# EAGLE schematic gbg_v01 (EAGLE 9.1.3)
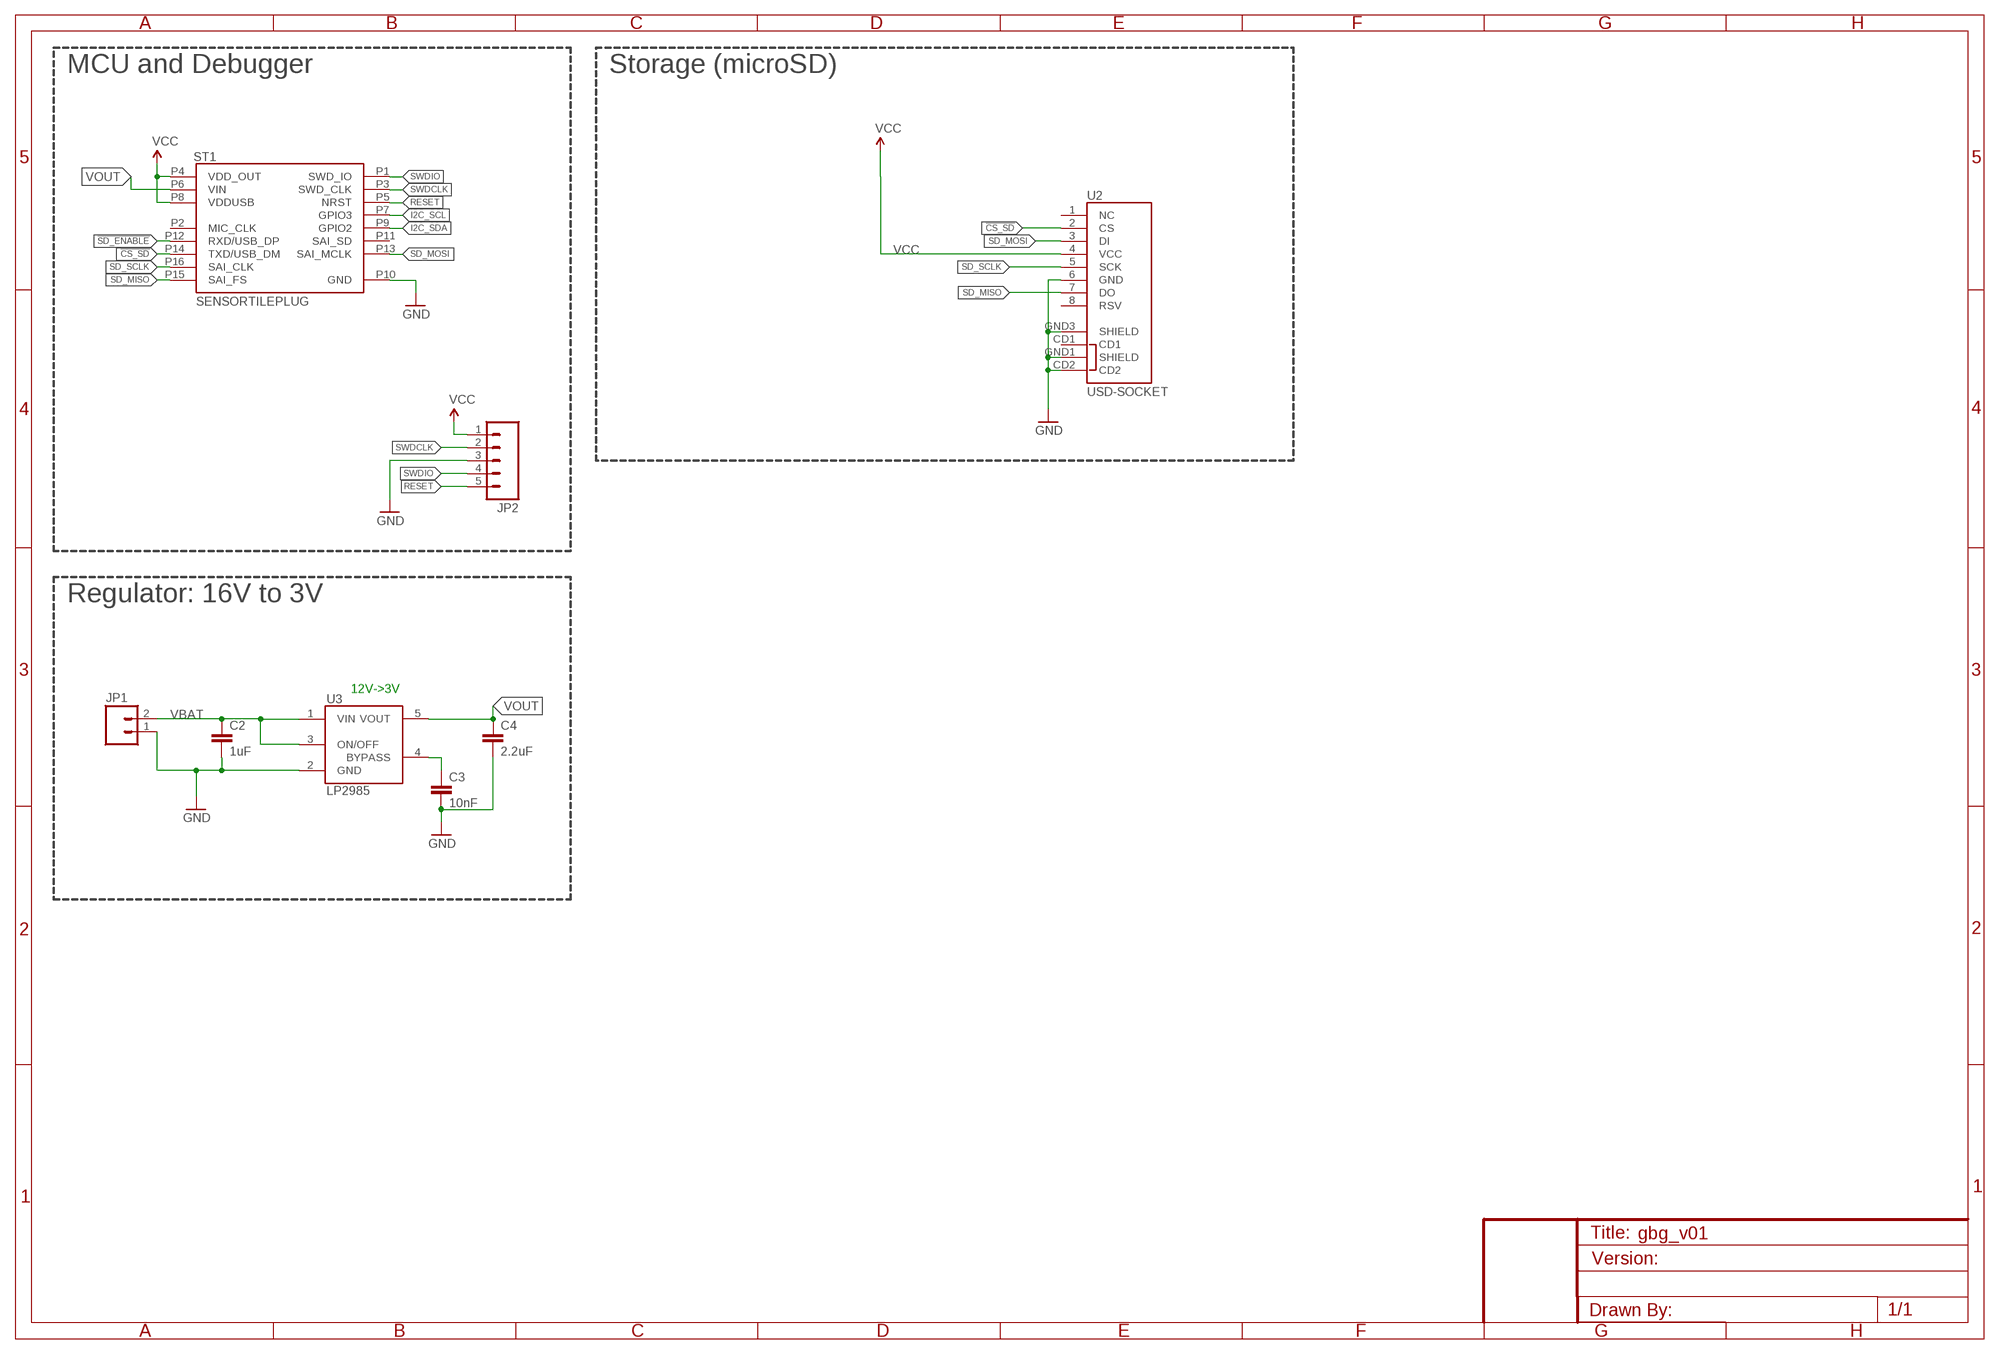
[diagram p0: schematic, sheet 1]

## Parts
C2  1uF  C-EU0603  [0603]
C3  10nF  C-EU0603  [0603]
C4  2.2uF  C-EU0603  [0603]
JP1  M025MM  [SCREWTERMINAL-5MM-2]
JP2  M05LOCK  [1X05_LOCK]
ST1  SENSORTILEPLUG  [BM10JC16]
U2  USD-SOCKET  [MICROSD_1:1]
U3  LP2985AIM5-3.3  [SOT25]

## Nets
!CS_SD: ST1.P14(TXD/USB_DM) U2.2(CS)
!SD_ENABLE: ST1.P12(RXD/USB_DP)
BYPASS: C3.1 U3.4(BYPASS)
GND: C2.2 C3.2 C4.2 JP1.1 JP2.3 ST1.P10(GND) U2.6(GND) U2.CD2 U2.GND1(SHIELD) U2.GND3(SHIELD) U3.2(GND)
I2C_SCL: ST1.P7(GPIO3)
I2C_SDA: ST1.P9(GPIO2)
RESET: JP2.5 ST1.P5(NRST)
SD_MISO: ST1.P15(SAI_FS) U2.7(DO)
SD_MOSI: ST1.P13(SAI_MCLK) U2.3(DI)
SD_SCLK: ST1.P16(SAI_CLK) U2.5(SCK)
SWDCLK: JP2.2 ST1.P3(SWD_CLK)
SWDIO: JP2.4 ST1.P1(SWD_IO)
VBAT: C2.1 JP1.2 U3.1(VIN) U3.3(ON/OFF)
VCC: JP2.1 ST1.P4(VDD_OUT) ST1.P8(VDDUSB) U2.4(VCC)
VOUT: C4.1 ST1.P6(VIN) U3.5(VOUT)
Unconnected: ST1.P2(MIC_CLK) ST1.P11(SAI_SD) U2.1(NC) U2.8(RSV) U2.CD1

## Notes on the sheet
- MCU and Debugger | Storage (microSD)
- Regulator: 16V to 3V
- 12V->3V

## Library data of the parts
C2-C4 = tiny_passives:C-EU
JP1 = SparkFun-Connectors:M02: Standard 2-pin 0.1" header. Use with - straight break away headers ( PRT-00116) - right angle break away headers (PRT-00553) - swiss pins (PRT-00743) - machine pins (PRT-00117) - female headers (PRT-00115) Molex polarized connector foot print use with: PRT-08233 with associated crimp pins and housings. 2.54_SCREWTERM for use with PRT-10571. 3.5mm Screw Terminal footprints for PRT-08084 5mm Screw Terminal footprints for use with PRT-08432; STOREFRONT_ID: PRT-08432
JP2 = SparkFun-Connectors:M05: Header 5 Standard 5-pin 0.1" header. Use with straight break away headers (SKU : PRT-00116), right angle break away headers (PRT-00553), swiss pins (PRT-00743), machine pins (PRT-00117), and female headers (PRT-00115). Molex polarized connector foot print use with SKU : PRT-08230 with associated crimp pins and housings.
ST1 = sensortile:SENSORTILE
U2 = SparkFun-Connectors:USD-SOCKET: microSD Socket Push-push type uSD socket. Schematic element and footprint production proven. Spark Fun Electronics SKU : PRT-00127. tDoc lines correctly indicate media card edge positions when inserting (unlocked, locked, depressed). NOTE: CD1 and CD2 are connected internally; DIGIKEY: WM3290CT-ND; PROD_ID: CONN-07820
U3 = LP2985:LP2985: LP2985-N Micropower 150 mA Low-Noise Ultra Low-Dropout Regulator; DIGIKEY: 296-32152-1-ND; MPN: LP2985-30DBVR